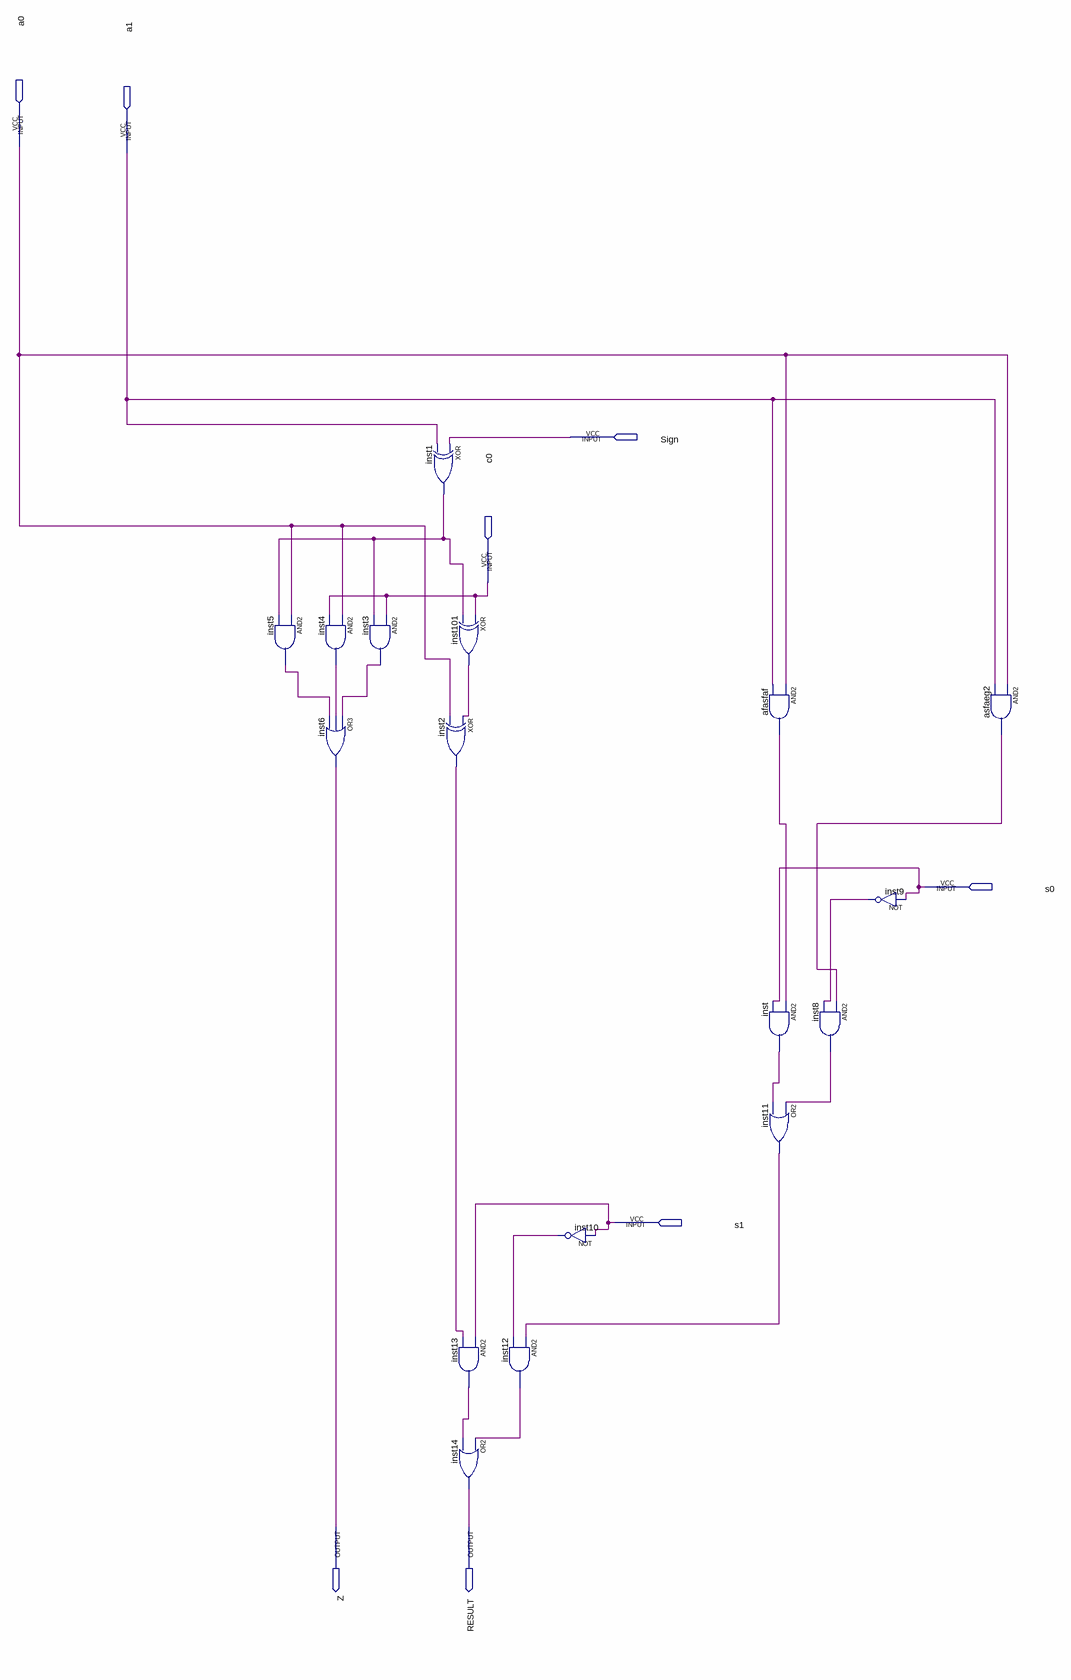
[diagram p0: schematic sheet]
// Quartus schematic ALU.bdf as structural Verilog: 17 symbols, 8 pins
module ALU (
  input  a0,
  input  a1,
  input  Sign,
  input  c0,
  input  s0,
  input  s1,
  output Z,
  output RESULT
);

  wire afasfaf_out, asfaeg2_out, inst1_out, inst2_out, inst3_out, inst4_out, inst5_out, inst8_out, inst9_out,
       inst10_out, inst11_out, inst12_out, inst13_out, inst101_out, inst_out;

  and inst5 (inst5_out, a0, inst1_out);
  and inst4 (inst4_out, a0, c0);
  or inst6 (Z, inst3_out, inst4_out, inst5_out);
  and inst3 (inst3_out, c0, inst1_out);
  xor inst1 (inst1_out, Sign, a1);
  xor inst101 (inst101_out, c0, inst1_out);
  xor inst2 (inst2_out, inst101_out, a0);
  and inst13 (inst13_out, s1, inst2_out);
  or inst14 (RESULT, inst12_out, inst13_out);
  and inst12 (inst12_out, inst11_out, inst10_out);
  not inst10 (inst10_out, s1);
  and afasfaf (afasfaf_out, a0, a1);
  and inst (inst_out, afasfaf_out, s0);
  or inst11 (inst11_out, inst8_out, inst_out);
  and inst8 (inst8_out, asfaeg2_out, inst9_out);
  not inst9 (inst9_out, s0);
  and asfaeg2 (asfaeg2_out, a0, a1);
endmodule
